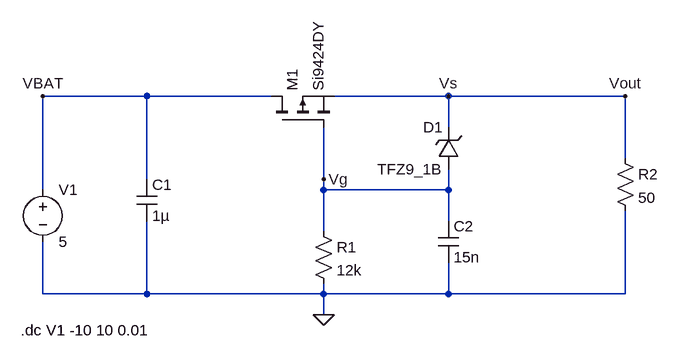
[diagram p0: schematic BatPolarityProtection.asc]
BatPolarityProtection.asc, the LTspice schematic file:
Version 4
SHEET 1 880 680
WIRE -48 -128 -208 -128
WIRE 144 -128 -48 -128
WIRE 416 -128 240 -128
WIRE 688 -128 416 -128
WIRE 416 -80 416 -128
WIRE 688 -32 688 -128
WIRE -48 0 -48 -128
WIRE 224 0 224 -80
WIRE -208 16 -208 -128
WIRE 224 16 224 0
WIRE 416 16 416 -16
WIRE 416 16 224 16
WIRE 416 64 416 16
WIRE 224 80 224 16
WIRE -208 176 -208 96
WIRE -48 176 -48 64
WIRE -48 176 -208 176
WIRE 224 176 224 160
WIRE 224 176 -48 176
WIRE 416 176 416 128
WIRE 416 176 224 176
WIRE 688 176 688 48
WIRE 688 176 416 176
WIRE 224 208 224 176
FLAG 224 208 0
FLAG -208 -128 VBAT
FLAG 224 0 Vg
FLAG 416 -128 Vs
FLAG 688 -128 Vout
SYMBOL pmos 144 -80 R270
SYMATTR InstName M1
SYMATTR Value Si9424DY
SYMBOL res 208 64 R0
SYMATTR InstName R1
SYMATTR Value 12k
SYMATTR SpiceLine tol=1 pwr=0.1
SYMBOL cap -64 0 R0
SYMATTR InstName C1
SYMATTR Value 1µ
SYMATTR SpiceLine V=25
SYMBOL voltage -208 0 R0
WINDOW 123 0 0 Left 0
WINDOW 39 0 0 Left 0
SYMATTR InstName V1
SYMATTR Value 5
SYMBOL res 672 -48 R0
SYMATTR InstName R2
SYMATTR Value 50
SYMBOL cap 400 64 R0
SYMATTR InstName C2
SYMATTR Value 15n
SYMBOL zener 432 -16 R180
WINDOW 0 24 64 Left 2
WINDOW 3 24 0 Left 2
SYMATTR InstName D1
SYMATTR Value TFZ9_1B
TEXT -242 232 Left 2 !.dc V1 -10 10 0.01

The netlist it stands for:
* BatPolarityProtection.asc
M1 VBAT Vg Vout Vout Si9424DY
R1 Vg 0 12k tol=1 pwr=0.1
C1 VBAT 0 1µ V=25
V1 VBAT 0 5
R2 Vout 0 50
C2 Vg 0 15n
D1 Vg Vout TFZ9_1B
.model D D
.lib standard.dio
.model NMOS NMOS
.model PMOS PMOS
.lib standard.mos
.dc V1 -10 10 0.01
.backanno
.end

* Results of the author's LTspice run, read from the files saved beside the schematic
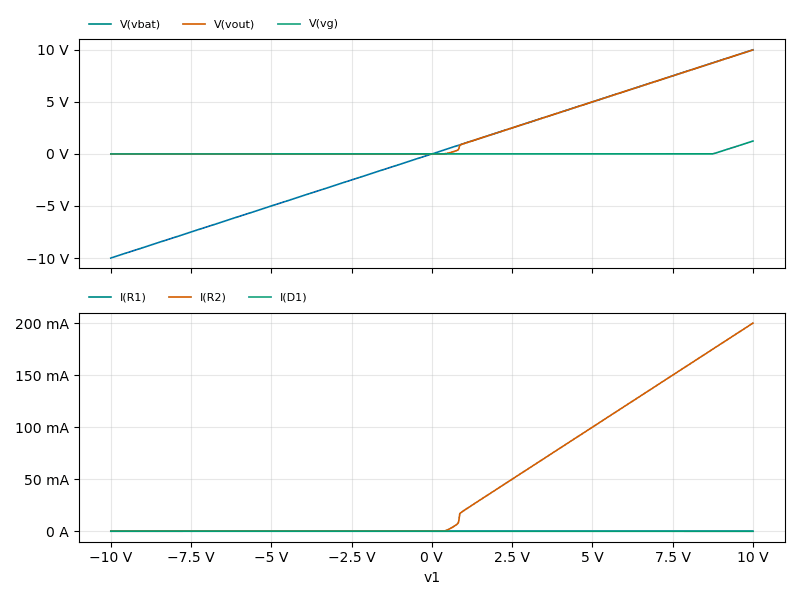
[diagram p1: DC transfer characteristic of BatPolarityProtection.asc, plotted from the saved traces]
* DC transfer characteristic, 1 run:
*   V(vbat): -10 V at v1=-10 V, 10 V at v1=10 V, min -10 V, max 10 V
*   V(vout): -36.52 nV at v1=-10 V, 9.996 V at v1=10 V, min -36.52 nV, max 9.996 V
*   V(vg): -44.85 fV at v1=-10 V, 1.233 V at v1=10 V, min -44.85 fV, max 1.233 V
*   I(R1): -0.003738 fA at v1=-10 V, 102.8 µA at v1=10 V, min -0.003738 fA, max 102.8 µA
*   I(R2): -730.3 pA at v1=-10 V, 199.9 mA at v1=10 V, min -730.3 pA, max 199.9 mA
*   I(D1): 0.003738 fA at v1=-10 V, -102.8 µA at v1=10 V, min -102.8 µA, max 0.003738 fA